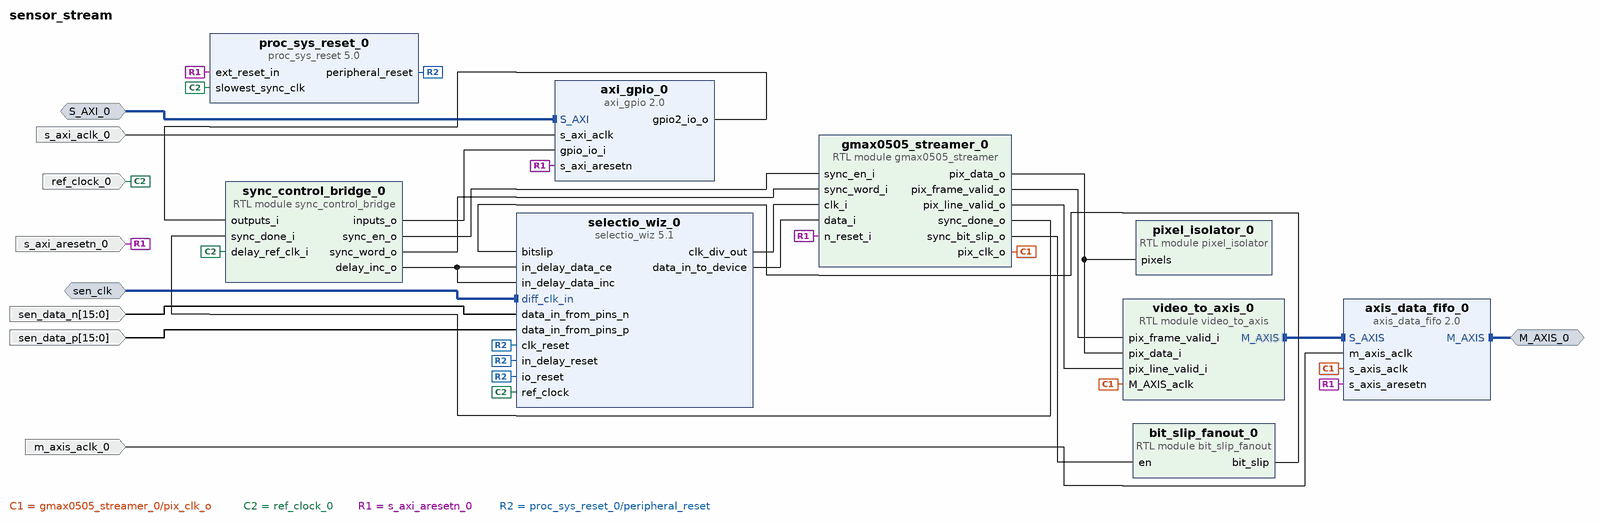
[diagram p0: block diagram of the top level]
# Vivado block design sensor_stream, xc7z014sclg484-1, Vivado 2023.1
create_bd_design sensor_stream

create_bd_intf_port -mode Slave -vlnv xilinx.com:interface:diff_clock_rtl:1.0 sen_clk
create_bd_intf_port -mode Master -vlnv xilinx.com:interface:axis_rtl:1.0 M_AXIS_0
set_property -dict {CONFIG.FREQ_HZ 200000000 CONFIG.PHASE 0.000} [get_bd_intf_ports M_AXIS_0]
create_bd_intf_port -mode Slave -vlnv xilinx.com:interface:aximm_rtl:1.0 S_AXI_0
set_property -dict [list \
  CONFIG.ADDR_WIDTH 16 \
  CONFIG.ARUSER_WIDTH 0 \
  CONFIG.AWUSER_WIDTH 0 \
  CONFIG.BUSER_WIDTH 0 \
  CONFIG.DATA_WIDTH 32 \
  CONFIG.HAS_BRESP 1 \
  CONFIG.HAS_BURST 0 \
  CONFIG.HAS_CACHE 0 \
  CONFIG.HAS_LOCK 0 \
  CONFIG.HAS_PROT 0 \
  CONFIG.HAS_QOS 0 \
  CONFIG.HAS_REGION 0 \
  CONFIG.HAS_RRESP 1 \
  CONFIG.HAS_WSTRB 1 \
  CONFIG.ID_WIDTH 0 \
  CONFIG.MAX_BURST_LENGTH 1 \
  CONFIG.NUM_READ_OUTSTANDING 1 \
  CONFIG.NUM_READ_THREADS 1 \
  CONFIG.NUM_WRITE_OUTSTANDING 1 \
  CONFIG.NUM_WRITE_THREADS 1 \
  CONFIG.PROTOCOL AXI4LITE \
  CONFIG.READ_WRITE_MODE READ_WRITE \
  CONFIG.RUSER_BITS_PER_BYTE 0 \
  CONFIG.RUSER_WIDTH 0 \
  CONFIG.SUPPORTS_NARROW_BURST 0 \
  CONFIG.WUSER_BITS_PER_BYTE 0 \
  CONFIG.WUSER_WIDTH 0 \
] [get_bd_intf_ports S_AXI_0]
create_bd_port -dir I -from 15 -to 0 sen_data_n
create_bd_port -dir I -from 15 -to 0 sen_data_p
create_bd_port -dir I -type clk m_axis_aclk_0
set_property -dict {CONFIG.FREQ_HZ 200000000 CONFIG.PHASE 0.000} [get_bd_ports m_axis_aclk_0]
create_bd_port -dir I -type clk s_axi_aclk_0
create_bd_port -dir I -type rst s_axi_aresetn_0
create_bd_port -dir I ref_clock_0

create_bd_cell -type ip -vlnv xilinx.com:ip:axis_data_fifo:2.0 axis_data_fifo_0
set_property -dict {CONFIG.FIFO_DEPTH 256 CONFIG.IS_ACLK_ASYNC 1} [get_bd_cells axis_data_fifo_0]
create_bd_cell -type ip -vlnv xilinx.com:ip:axi_gpio:2.0 axi_gpio_0
set_property -dict [list \
  CONFIG.C_ALL_INPUTS 1 \
  CONFIG.C_ALL_OUTPUTS_2 1 \
  CONFIG.C_GPIO2_WIDTH 32 \
  CONFIG.C_GPIO_WIDTH 32 \
  CONFIG.C_IS_DUAL 1 \
] [get_bd_cells axi_gpio_0]
create_bd_cell -type module -reference video_to_axis video_to_axis_0
create_bd_cell -type module -reference pixel_isolator pixel_isolator_0
create_bd_cell -type module -reference gmax0505_streamer gmax0505_streamer_0
create_bd_cell -type ip -vlnv xilinx.com:ip:selectio_wiz:5.1 selectio_wiz_0
set_property -dict [list \
  CONFIG.BUS_IO_STD DIFF_HSTL_II_18 \
  CONFIG.BUS_SIG_TYPE DIFF \
  CONFIG.CLK_FWD_IO_STD DIFF_HSTL_II_18 \
  CONFIG.CLK_FWD_SIG_TYPE DIFF \
  CONFIG.SELIO_ACTIVE_EDGE DDR \
  CONFIG.SELIO_BUS_IN_DELAY VARIABLE \
  CONFIG.SELIO_CLK_IO_STD DIFF_HSTL_II_18 \
  CONFIG.SELIO_CLK_SIG_TYPE DIFF \
  CONFIG.SELIO_INTERFACE_TYPE NETWORKING \
  CONFIG.SERIALIZATION_FACTOR 6 \
  CONFIG.SYSTEM_DATA_WIDTH 16 \
  CONFIG.USE_SERIALIZATION true \
] [get_bd_cells selectio_wiz_0]
create_bd_cell -type module -reference bit_slip_fanout bit_slip_fanout_0
create_bd_cell -type ip -vlnv xilinx.com:ip:proc_sys_reset:5.0 proc_sys_reset_0
create_bd_cell -type module -reference sync_control_bridge sync_control_bridge_0

# ---- connections ----

connect_bd_intf_net -intf_net S_AXI_0_1 [get_bd_intf_ports S_AXI_0] [get_bd_intf_pins axi_gpio_0/S_AXI]
connect_bd_intf_net [get_bd_intf_ports M_AXIS_0] [get_bd_intf_pins axis_data_fifo_0/M_AXIS]
connect_bd_intf_net [get_bd_intf_ports sen_clk] [get_bd_intf_pins selectio_wiz_0/diff_clk_in]
connect_bd_intf_net [get_bd_intf_pins video_to_axis_0/M_AXIS] [get_bd_intf_pins axis_data_fifo_0/S_AXIS]
connect_bd_net [get_bd_pins axi_gpio_0/gpio2_io_o] [get_bd_pins sync_control_bridge_0/outputs_i]
connect_bd_net [get_bd_pins bit_slip_fanout_0/bit_slip] [get_bd_pins selectio_wiz_0/bitslip]
connect_bd_net [get_bd_pins gmax0505_streamer_0/pix_clk_o] [get_bd_pins axis_data_fifo_0/s_axis_aclk] [get_bd_pins video_to_axis_0/M_AXIS_aclk]
connect_bd_net [get_bd_pins gmax0505_streamer_0/pix_data_o] [get_bd_pins video_to_axis_0/pix_data_i] [get_bd_pins pixel_isolator_0/pixels]
connect_bd_net [get_bd_pins gmax0505_streamer_0/pix_frame_valid_o] [get_bd_pins video_to_axis_0/pix_frame_valid_i]
connect_bd_net [get_bd_pins gmax0505_streamer_0/pix_line_valid_o] [get_bd_pins video_to_axis_0/pix_line_valid_i]
connect_bd_net [get_bd_pins gmax0505_streamer_0/sync_bit_slip_o] [get_bd_pins bit_slip_fanout_0/en]
connect_bd_net [get_bd_pins gmax0505_streamer_0/sync_done_o] [get_bd_pins sync_control_bridge_0/sync_done_i]
connect_bd_net -net m_axis_aclk_0_1 [get_bd_ports m_axis_aclk_0] [get_bd_pins axis_data_fifo_0/m_axis_aclk]
connect_bd_net -net ref_clock_0_1 [get_bd_ports ref_clock_0] \
  [get_bd_pins selectio_wiz_0/ref_clock] [get_bd_pins proc_sys_reset_0/slowest_sync_clk] \
  [get_bd_pins sync_control_bridge_0/delay_ref_clk_i]
connect_bd_net -net s_axi_aclk_0_1 [get_bd_ports s_axi_aclk_0] [get_bd_pins axi_gpio_0/s_axi_aclk]
connect_bd_net -net s_axi_aresetn_0_1 [get_bd_ports s_axi_aresetn_0] \
  [get_bd_pins axi_gpio_0/s_axi_aresetn] [get_bd_pins axis_data_fifo_0/s_axis_aresetn] \
  [get_bd_pins gmax0505_streamer_0/n_reset_i] [get_bd_pins proc_sys_reset_0/ext_reset_in]
connect_bd_net [get_bd_pins selectio_wiz_0/clk_div_out] [get_bd_pins gmax0505_streamer_0/clk_i]
connect_bd_net [get_bd_pins selectio_wiz_0/data_in_to_device] [get_bd_pins gmax0505_streamer_0/data_i]
connect_bd_net [get_bd_ports sen_data_n] [get_bd_pins selectio_wiz_0/data_in_from_pins_n]
connect_bd_net [get_bd_ports sen_data_p] [get_bd_pins selectio_wiz_0/data_in_from_pins_p]
connect_bd_net [get_bd_pins sync_control_bridge_0/delay_inc_o] \
  [get_bd_pins selectio_wiz_0/in_delay_data_inc] [get_bd_pins selectio_wiz_0/in_delay_data_ce]
connect_bd_net [get_bd_pins sync_control_bridge_0/inputs_o] [get_bd_pins axi_gpio_0/gpio_io_i]
connect_bd_net -net sync_control_bridge_0_sync_en_0 [get_bd_pins sync_control_bridge_0/sync_en_o] [get_bd_pins gmax0505_streamer_0/sync_en_i]
connect_bd_net [get_bd_pins sync_control_bridge_0/sync_word_o] [get_bd_pins gmax0505_streamer_0/sync_word_i]
connect_bd_net -net xlconstant_0_dout [get_bd_pins proc_sys_reset_0/peripheral_reset] \
  [get_bd_pins selectio_wiz_0/clk_reset] [get_bd_pins selectio_wiz_0/io_reset] [get_bd_pins selectio_wiz_0/in_delay_reset]

# ---- address map ----
assign_bd_address -offset 0x0000 -range 4K -target_address_space [get_bd_addr_spaces S_AXI_0] [get_bd_addr_segs axi_gpio_0/S_AXI/Reg]

validate_bd_design
save_bd_design
